# EAGLE design NanoV3.3 new board (EAGLE 9.3.2)
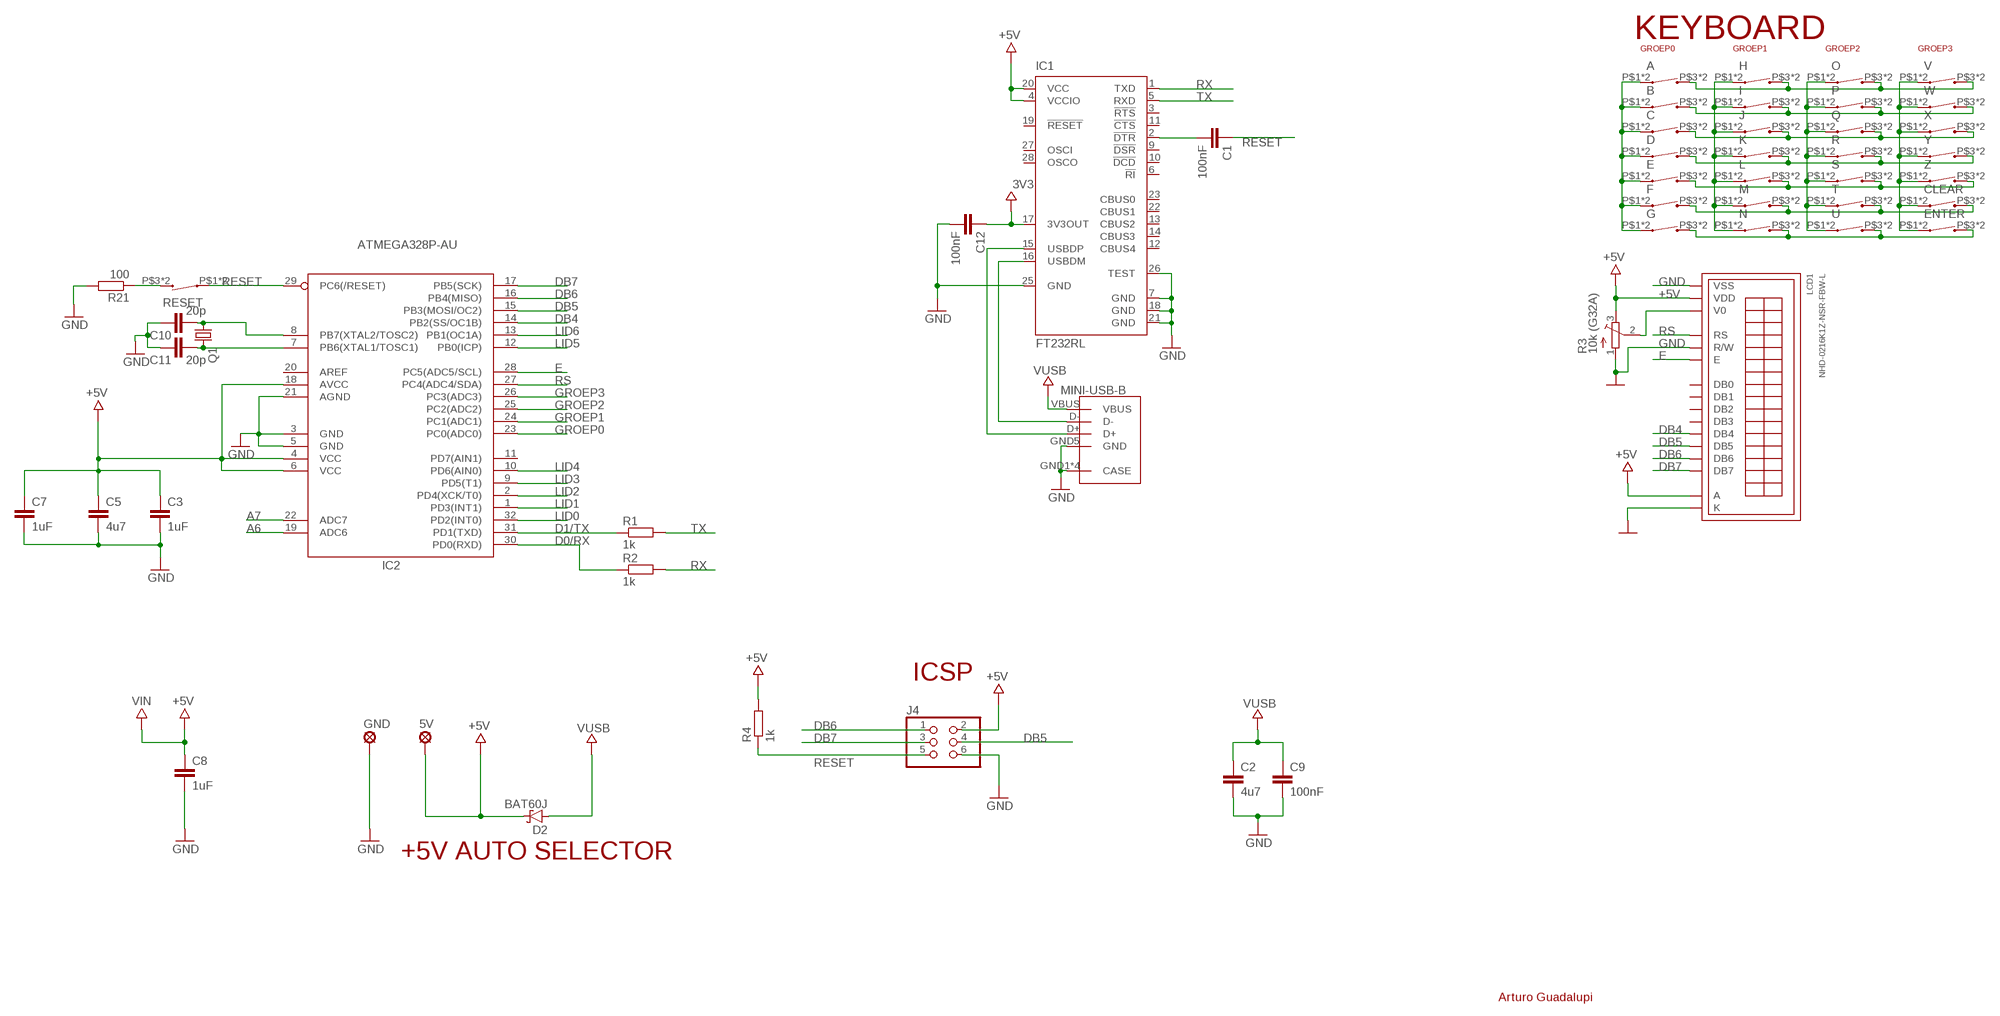
[diagram p0: schematic, sheet 1]

## Parts
5V  LSP10  [LSP10]
A  BRIGHTTSA061G100-250_SWITCH  [BRIGHTTSA061G100-250]
B  BRIGHTTSA061G100-250_SWITCH  [BRIGHTTSA061G100-250]
C  BRIGHTTSA061G100-250_SWITCH  [BRIGHTTSA061G100-250]
C1  100nF  C-EUC0805  [C0805]
C2  4u7  C-EUC0805  [C0805]
C3  1uF  C-EUC0805  [C0805]
C5  4u7  C-EUC0805  [C0805]
C7  1uF  C-EUC0805  [C0805]
C8  1uF  C-EUC0805  [C0805]
C9  100nF  C-EUC0805  [C0805]
C10  20p  C-EUC0805  [C0805]
C11  20p  C-EUC0805  [C0805]
C12  100nF  C-EUC0805  [C0805]
CLEAR  BRIGHTTSA061G100-250_SWITCH  [BRIGHTTSA061G100-250]
D  BRIGHTTSA061G100-250_SWITCH  [BRIGHTTSA061G100-250]
D2  BAT60J  [SOD323_ST]
E  BRIGHTTSA061G100-250_SWITCH  [BRIGHTTSA061G100-250]
ENTER  BRIGHTTSA061G100-250_SWITCH  [BRIGHTTSA061G100-250]
F  BRIGHTTSA061G100-250_SWITCH  [BRIGHTTSA061G100-250]
G  BRIGHTTSA061G100-250_SWITCH  [BRIGHTTSA061G100-250]
GND  LSP10  [LSP10]
H  BRIGHTTSA061G100-250_SWITCH  [BRIGHTTSA061G100-250]
I  BRIGHTTSA061G100-250_SWITCH  [BRIGHTTSA061G100-250]
IC1  FT232RL  [SSOP28]
IC2  ATMEGA328P-AU  ATMEGA328P-32AU  [TQFP32-08]
J  BRIGHTTSA061G100-250_SWITCH  [BRIGHTTSA061G100-250]
J4  0114_PH254-203DF118A00V  [2X03]
K  BRIGHTTSA061G100-250_SWITCH  [BRIGHTTSA061G100-250]
L  BRIGHTTSA061G100-250_SWITCH  [BRIGHTTSA061G100-250]
LCD1  NHD-0216K1Z-NSR-FBW-L  GEN-DISPLAY-16X2-LCD  [LCD_NO-HEAD]
M  BRIGHTTSA061G100-250_SWITCH  [BRIGHTTSA061G100-250]
MINI-USB-B  MINI_USB_B-KRHRO-SELECU-M-M5DS-W-4  [KRHROSELECU-M-M5DS-W-4]
N  BRIGHTTSA061G100-250_SWITCH  [BRIGHTTSA061G100-250]
O  BRIGHTTSA061G100-250_SWITCH  [BRIGHTTSA061G100-250]
P  BRIGHTTSA061G100-250_SWITCH  [BRIGHTTSA061G100-250]
Q  BRIGHTTSA061G100-250_SWITCH  [BRIGHTTSA061G100-250]
Q1  CRYSTALHC49U70  [HC49U70]
R  BRIGHTTSA061G100-250_SWITCH  [BRIGHTTSA061G100-250]
R1  1k  R-EU_R0805  [R0805]
R2  1k  R-EU_R0805  [R0805]
R3  10k (G32A)  TRIM_EU-3223W  [3223W]
R4  1k  R-EU_R0805  [R0805]
R21  100  R-EU_R0805  [R0805]
RESET  BRIGHTTSA061G100-250_SWITCH  [BRIGHTTSA061G100-250]
S  BRIGHTTSA061G100-250_SWITCH  [BRIGHTTSA061G100-250]
T  BRIGHTTSA061G100-250_SWITCH  [BRIGHTTSA061G100-250]
U  BRIGHTTSA061G100-250_SWITCH  [BRIGHTTSA061G100-250]
V  BRIGHTTSA061G100-250_SWITCH  [BRIGHTTSA061G100-250]
W  BRIGHTTSA061G100-250_SWITCH  [BRIGHTTSA061G100-250]
X  BRIGHTTSA061G100-250_SWITCH  [BRIGHTTSA061G100-250]
Y  BRIGHTTSA061G100-250_SWITCH  [BRIGHTTSA061G100-250]
Z  BRIGHTTSA061G100-250_SWITCH  [BRIGHTTSA061G100-250]

## Nets
3V3 [small]: C12.1 IC1.17(3V3OUT)
+5V [small]: 5V.MP C3.1 C5.1 C7.1 C8.1 D2.C IC1.4(VCCIO) IC1.20(VCC) IC2.4(VCC) IC2.6(VCC) IC2.18(AVCC) J4.2 LCD1.2(VDD) LCD1.15(A) R3.3(E) R4.2 ; supply symbol labelled VIN
A6: IC2.19(ADC6)
A7: IC2.22(ADC7)
D0/RX [small]: IC2.30(PD0(RXD)) R2.1
D1/TX [small]: IC2.31(PD1(TXD)) R1.1
DB4 [small]: IC2.14(PB2(SS/OC1B)) LCD1.11(DB4)
DB5 [small]: IC2.15(PB3(MOSI/OC2)) J4.4 LCD1.12(DB5)
DB6 [small]: IC2.16(PB4(MISO)) J4.1 LCD1.13(DB6)
DB7 [small]: IC2.17(PB5(SCK)) J4.3 LCD1.14(DB7)
E: IC2.28(PC5(ADC5/SCL)) LCD1.6(E)
GND [small]: C2.2 C3.2 C5.2 C7.2 C8.2 C9.2 C10.1 C11.1 C12.2 GND.MP IC1.7(GND) IC1.18(GND) IC1.21(GND) IC1.25(GND) IC1.26(TEST) IC2.3(GND) IC2.5(GND) IC2.21(AGND) J4.6 LCD1.1(VSS) LCD1.5(R/W) LCD1.16(K) MINI-USB-B.GND1(CASE) MINI-USB-B.GND2(CASE) MINI-USB-B.GND3(CASE) MINI-USB-B.GND4(CASE) MINI-USB-B.GND5(GND) R3.1(A) R21.2
GROEP0: A.P$1 A.P$2 B.P$1 B.P$2 C.P$1 C.P$2 D.P$1 D.P$2 E.P$1 E.P$2 F.P$1 F.P$2 G.P$1 G.P$2 IC2.23(PC0(ADC0))
GROEP1: H.P$1 H.P$2 I.P$1 I.P$2 IC2.24(PC1(ADC1)) J.P$1 J.P$2 K.P$1 K.P$2 L.P$1 L.P$2 M.P$1 M.P$2 N.P$1 N.P$2
GROEP2: IC2.25(PC2(ADC2)) O.P$1 O.P$2 P.P$1 P.P$2 Q.P$1 Q.P$2 R.P$1 R.P$2 S.P$1 S.P$2 T.P$1 T.P$2 U.P$1 U.P$2
GROEP3: CLEAR.P$1 CLEAR.P$2 ENTER.P$1 ENTER.P$2 IC2.26(PC3(ADC3)) V.P$1 V.P$2 W.P$1 W.P$2 X.P$1 X.P$2 Y.P$1 Y.P$2 Z.P$1 Z.P$2
LID0: A.P$3 A.P$4 H.P$3 H.P$4 IC2.32(PD2(INT0)) O.P$3 O.P$4 V.P$3 V.P$4
LID1: B.P$3 B.P$4 I.P$3 I.P$4 IC2.1(PD3(INT1)) P.P$3 P.P$4 W.P$3 W.P$4
LID2: C.P$3 C.P$4 IC2.2(PD4(XCK/T0)) J.P$3 J.P$4 Q.P$3 Q.P$4 X.P$3 X.P$4
LID3: D.P$3 D.P$4 IC2.9(PD5(T1)) K.P$3 K.P$4 R.P$3 R.P$4 Y.P$3 Y.P$4
LID4: E.P$3 E.P$4 IC2.10(PD6(AIN0)) L.P$3 L.P$4 S.P$3 S.P$4 Z.P$3 Z.P$4
LID5: CLEAR.P$3 CLEAR.P$4 F.P$3 F.P$4 IC2.12(PB0(ICP)) M.P$3 M.P$4 T.P$3 T.P$4
LID6: ENTER.P$3 ENTER.P$4 G.P$3 G.P$4 IC2.13(PB1(OC1A)) N.P$3 N.P$4 U.P$3 U.P$4
N$1: C10.2 IC2.8(PB7(XTAL2/TOSC2)) Q1.1
N$2: C11.2 IC2.7(PB6(XTAL1/TOSC1)) Q1.2
N$3: LCD1.3(V0) R3.2(S)
N$5: IC1.15(USBDP) MINI-USB-B.D+
N$6: IC1.16(USBDM) MINI-USB-B.D-
N$8: C1.2 IC1.2(!DTR)
N$15: R21.1 RESET.P$3 RESET.P$4
RESET: C1.1 IC2.29(PC6(/RESET)) J4.5 R4.1 RESET.P$1 RESET.P$2
RS: IC2.27(PC4(ADC4/SDA)) LCD1.4(RS)
RX [small]: IC1.1(TXD) R2.2
TX [small]: IC1.5(RXD) R1.2
VUSB: C2.1 C9.1 D2.A MINI-USB-B.VBUS
Unconnected: IC1.3(!RTS) IC1.6(!RI) IC1.9(!DSR) IC1.10(!DCD) IC1.11(!CTS) IC1.12(CBUS4) IC1.13(CBUS2) IC1.14(CBUS3) IC1.19(!RESET) IC1.22(CBUS1) IC1.23(CBUS0) IC1.27(OSCI) IC1.28(OSCO) IC2.11(PD7(AIN1)) IC2.20(AREF) LCD1.7(DB0) LCD1.8(DB1) LCD1.9(DB2) LCD1.10(DB3)

## Notes on the sheet
- KEYBOARD
- GROEP0 | GROEP1 | GROEP2 | GROEP3
- ICSP
- +5V AUTO SELECTOR
- Arturo Guadalupi

## Library data of the parts
5V GND = solpad:LSP10: SOLDER PAD drill 1.0 mm, distributor Buerklin, 12H555
A B C CLEAR D E ENTER F G H I J K L M N O P Q R RESET S T U V W X Y Z = switch BRIGHT TSA061G100-250lbr:BRIGHTTSA061G100-250_SWITCH
C1-C3 C5 C7-C12 = rcl:C-EU: CAPACITOR, European symbol; SPICEPREFIX: C
D2 = diode:BAT60J: Schottky barrier diode Source: www.st.com, BAT60J.pdf
IC1 = ftdichip:FT232R: Source: http://www.ftdichip.com/Documents/DataSheets/DS_FT232R_v104.pdf; MPN: FT232RL; OC_FARNELL: 1146032; OC_NEWARK: 91K9918
IC2 = Arduino-ucs&SoCs:ATMEGA328P-32: 8-bit Microcontroller with 32KBytes In-System Programmable Flash ATMEGA328P-AU; DATASHEET: http://www.atmel.com/images/Atmel-8271-8-bit-AVR-Microcontroller-ATmega48A-48PA-88A-88PA-168A-168PA-328-328P_datasheet_Complete.pdf; DISTRIBUTOR-LINK: https://www.digikey.it/product-detail/it/microchip-technology/ATMEGA328P-AU/ATMEGA328P-AU-ND/1832260; DISTRIBUTOR-PN: ATMEGA328P-AU-ND; MANUFACTURER: ATMEL; MANUFACTURER-PN: ATMEGA328P-AU
J4 = Connettori:0114_PH254-203DF118A00V: 3x2 M V h 8,5 mm p2,54; MONTHLY_USAGE: _____; PART_NUMBER: PH254-203DF118A00V; PRICE: _____; SUPPLIER: _____; TYPE: Connettori; VALUE: ICSP
LCD1 = lcd:GEN-DISPLAY-16X2-LCD: Display a cristalli liquidi tipo 162B Displaytech http://www.displaytech.com.hk/index.htm
MINI-USB-B = mini USB B Korean Hroparts Elec U-M-M5DS-W-4:MINI_USB_B-KRHRO-SELECU-M-M5DS-W-4: order from lcsc: https://lcsc.com/product-detail/USB-Connectors_Korean-Hroparts-Elec-U-M-M5DS-W-4_C188818.html datasheet: https://datasheet.lcsc.com/szlcsc/Korean-Hroparts-Elec-U-M-M5DS-W-4_C188818.pdf
Q1 = crystal:CRYSTAL: CRYSTAL; OC_FARNELL: unknown; OC_NEWARK: unknown
R1 R2 R4 R21 = rcl:R-EU_: RESISTOR, European symbol; SPICEPREFIX: R
R3 = pot:TRIM_EU-: POTENTIOMETER

## Net classes
0 default: width 0.254 mm, clearance 0.152 mm
1 small: width 0.381 mm, clearance 0.152 mm
2 very small: width 0.254 mm, clearance 0.152 mm

## Board
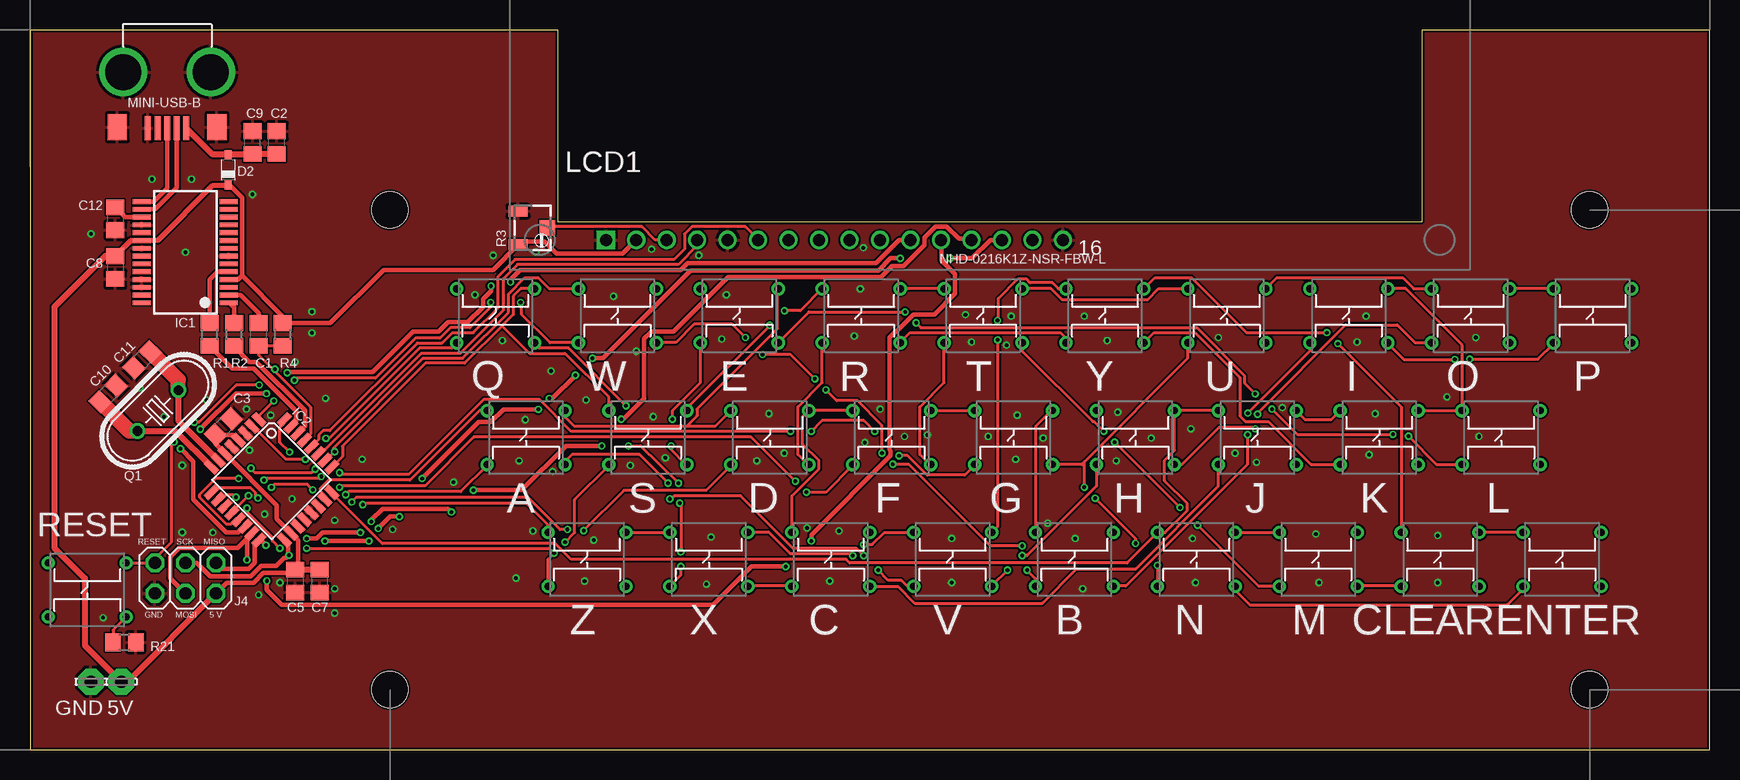
[diagram p1: board, top side]
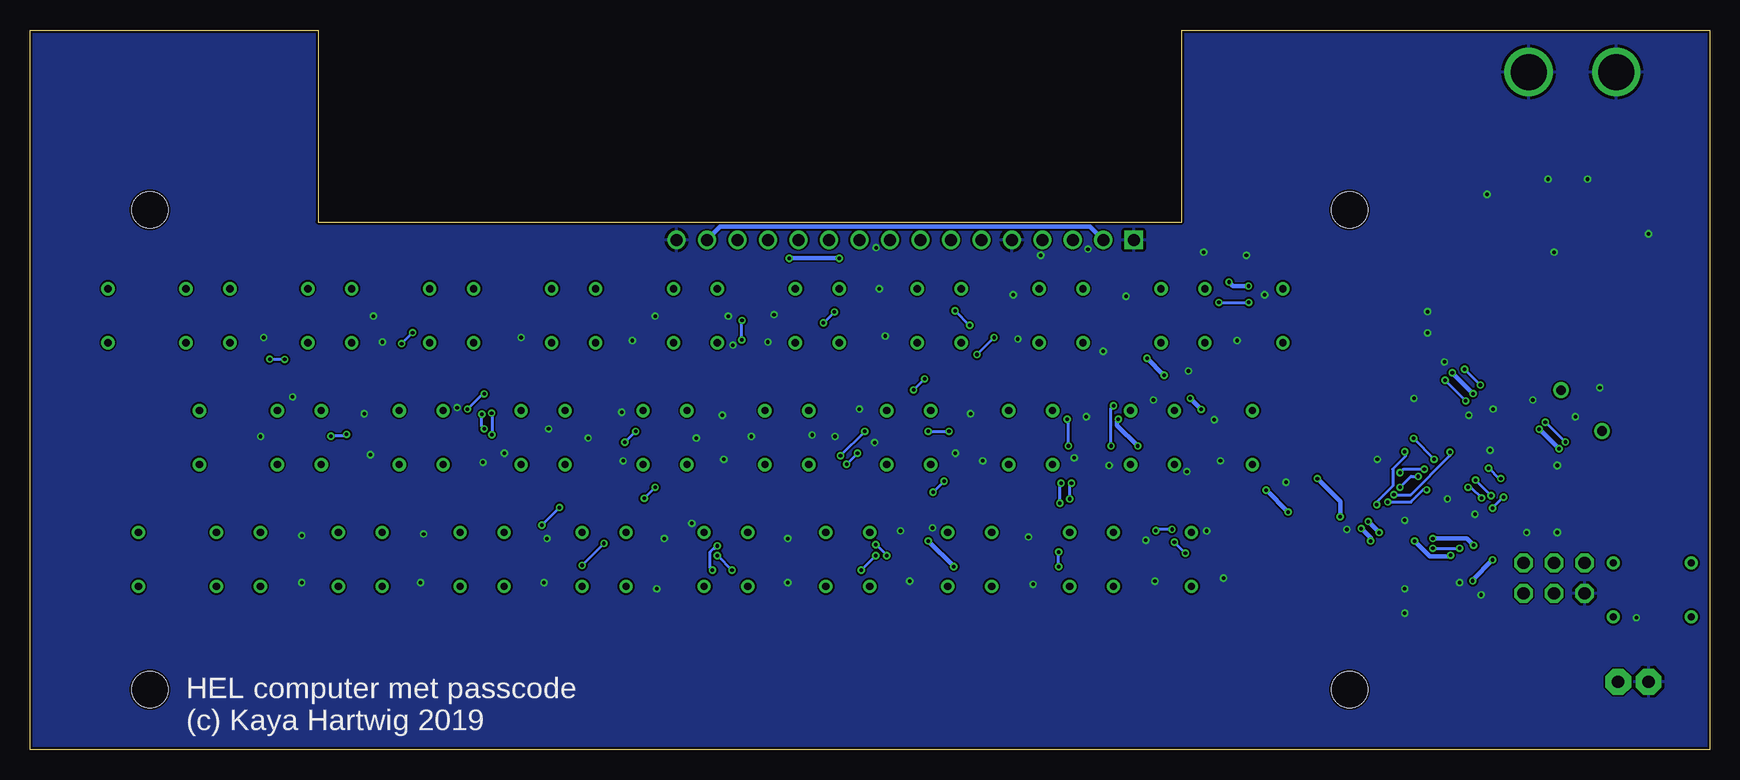
[diagram p2: board, bottom side, seen from below]

Size 140 x 60 mm. Coordinates in mm from the lower left corner, seen from the top.
Outline: 0,0 140,0 140,60 116,60 116,44 44,44 44,60 0,60 0,0
Copper layers (1*16): Top 0.035mm / dielectric 1.5mm / Bottom 0.035mm
Design rules "default": minimum track width 5mil, minimum drill 0.3mm, track to track 5mil, track to pad 5mil, pad to pad 5mil, via to via 5mil, smd to smd 5mil, copper to edge 0.2mm, drill to drill 6mil, minimum pad ring 10mil, minimum via ring 0.15mm, stop-mask expansion 4mil, vias tented up to drill 0mil, thermal gap 10mil
Holes 3 mm at 130,45 30,45 30,5 130,5

### Footprints (pad centres in the part's own frame; a part is rotated, then mirrored left to right if it is on the bottom)
LSP10 = drill 1.016 pad 2.159 octagon: MP 0,0
BRIGHTTSA061G100-250 = drill 0.6: P$1 0,0; P$2 6.5,0; P$3 0,-4.5; P$4 6.5,-4.5
C0805 = smd 1.3 x 1.5: 1 -0.95,0; 2 0.95,0
SOD323_ST = smd 0.8 x 0.6: A 1.25,0; C -1.25,0
SSOP28 = smd 0.4 x 1.5: 1 -4.225,-3.625; 2 -3.575,-3.625; 3 -2.925,-3.625; 4 -2.275,-3.625; 5 -1.625,-3.625; 6 -0.975,-3.625; 7 -0.325,-3.625; 8 0.325,-3.625; 9 0.975,-3.625; 10 1.625,-3.625; 11 2.275,-3.625; 12 2.925,-3.625; 13 3.575,-3.625; 14 4.225,-3.625; 15 4.225,3.625; 16 3.575,3.625; 17 2.925,3.625; 18 2.275,3.625; 19 1.625,3.625; 20 0.975,3.625; 21 0.325,3.625; 22 -0.325,3.625; 23 -0.975,3.625; 24 -1.625,3.625; 25 -2.275,3.625; 26 -2.925,3.625; 27 -3.575,3.625; 28 -4.225,3.625
TQFP32-08 = smd 1.27 x 0.559: 1 -4.293,2.8; 2 -4.293,2; 3 -4.293,1.2; 4 -4.293,0.4; 5 -4.293,-0.4; 6 -4.293,-1.2; 7 -4.293,-2; 8 -4.293,-2.8; 17 4.293,-2.8; 18 4.293,-2; 19 4.293,-1.2; 20 4.293,-0.4; 21 4.293,0.4; 22 4.293,1.2; 23 4.293,2; 24 4.293,2.8 | smd 0.559 x 1.27: 9 -2.8,-4.293; 10 -2,-4.293; 11 -1.2,-4.293; 12 -0.4,-4.293; 13 0.4,-4.293; 14 1.2,-4.293; 15 2,-4.293; 16 2.8,-4.293; 25 2.8,4.293; 26 2,4.293; 27 1.2,4.293; 28 0.4,4.293; 29 -0.4,4.293; 30 -1.2,4.293; 31 -2,4.293; 32 -2.8,4.293
2X03 = drill 1.016 pad 1.55 octagon: 1 -2.54,-1.27; 2 -2.54,1.27; 3 0,-1.27; 4 0,1.27; 5 2.54,-1.27; 6 2.54,1.27
LCD_NO-HEAD = drill 1 square: 1 8,2.5 | drill 1: 2 10.54,2.5; 3 13.08,2.5; 4 15.62,2.5; 5 18.16,2.5; 6 20.7,2.5; 7 23.24,2.5; 8 25.78,2.5; 9 28.32,2.5; 10 30.86,2.5; 11 33.4,2.5; 12 35.94,2.5; 13 38.48,2.5; 14 41.02,2.5; 15 43.56,2.5; 16 46.1,2.5
KRHROSELECU-M-M5DS-W-4 = smd 0.5 x 2: D+ 0,-0.8; D- -0.8,-0.8; GND5 1.6,-0.8; P$2 0.8,-0.8; VBUS -1.6,-0.8 | smd 1.6 x 2.2: GND1 -4.15,-0.9; GND2 4.15,-0.9 | drill 3: GND3 3.65,-5.5; GND4 -3.65,-5.5
HC49U70 = drill 0.813: 1 -2.413,0; 2 2.413,0
R0805 = smd 1.3 x 1.5: 1 -0.95,0; 2 0.95,0
3223W = smd 0.9 x 1.6: 1 -1.4,-1.215; 3 1.4,-1.215 | smd 1.3 x 1.3: 2 0,1.215

### Placement (x,y rotation side)
5V  7.62,5.65 0 top
A  38.1,28.26 0 top
B  83.82,18.1 0 top
C  63.5,18.1 0 top
C1  19.05,34.61 90 top
C2  20.57,50.61 90 top
C3  16.13,26.91 45 top
C5  22.1,14.04 270 top
C7  24.13,14.04 270 top
C8  7.11,40.2 270 top
C9  18.54,50.61 90 top
C10  6.51,29.67 225 top
C11  9.35,32.5 45 top
C12  7.11,44.26 270 top
CLEAR  114.3,18.1 0 top
D  58.42,28.26 0 top
D2  16.51,48.33 90 top
E  55.88,38.42 0 top
ENTER  124.46,18.1 0 top
F  68.58,28.26 0 top
G  78.74,28.26 0 top
GND  5.08,5.65 0 top
H  88.9,28.26 0 top
I  106.68,38.42 0 top
IC1  12.95,41.47 90 top
IC2  20.14,22.49 315 top
J  99.06,28.26 0 top
J4  12.95,14.29 180 top
K  109.22,28.26 0 top
L  119.38,28.26 0 top
LCD1  40,40 0 top
M  104.14,18.1 0 top
MINI-USB-B  11.43,51 180 top
N  93.98,18.1 0 top
O  116.84,38.42 0 top
P  127,38.42 0 top
Q  35.56,38.42 0 top
Q1  10.67,28.26 45 top
R  66.04,38.42 0 top
R1  14.99,34.61 90 top
R2  17.02,34.61 90 top
R3  41.91,43.5 270 top
R4  21.08,34.61 90 top
R21  7.87,8.96 0 top
RESET  1.52,15.56 0 top
S  48.26,28.26 0 top
T  76.2,38.42 0 top
U  96.52,38.42 0 top
V  73.66,18.1 0 top
W  45.72,38.42 0 top
X  53.34,18.1 0 top
Y  86.36,38.42 0 top
Z  43.18,18.1 0 top

### Tracks (layer width: path | path; a pad name or v marks a point on that pad's centre or on a via)
3V3
  Top 0.381: IC1.17 7.93,44.39 C12.1
+5V
  Top 0.381: 22.35,14.99 22.35,17.45 IC2.18 20.57,19.23 20.57,20.36 IC2.6 15.43,25.5 C3.1 16.96,26.24 IC2.4 | 16.49,47.06 D2.C 16.63,47.08 17.67,46.03 17.67,39.5 | 6.28,41.15 C8.1 | 17.67,39.5 17.36,39.19 IC1.4 | 17.67,39.5 21.08,36.09 R4.2 21.09,35.55 25.02,35.55 29.46,39.99 38.59,39.99 R3.3 40.95,42.35 42.9,42.35 43.89,41.37 49.38,41.37 50.49,42.48 LCD1.2 | C5.1 21.83,14.71 19.44,14.71 18.63,13.9 16.38,13.9 J4.2
  Top 0.432: C8.1 8.41,42.44 IC1.20 10.63,42.44 15.24,47.06 16.49,47.06
  Top 0.508: 6.28,41.15 2.03,36.9 2.03,16.83 4.57,14.29 4.57,8.7 5V.MP 8.13,5.65 J4.2 | C7.1 22.35,14.99 C5.1
  Bottom 0.381: LCD1.15 82.46,43.6 51.64,43.6 LCD1.2
D0/RX
  Top 0.381: IC2.30 22.92,26.97 22.92,28.26 18.86,32.32 18.29,32.32 17.02,33.59 R2.1
D1/TX
  Top 0.381: R1.1 16.86,31.79 18.64,31.79 22.18,28.24 22.18,27.37 IC2.31
DB4  (via drill 0.3 pad 0.6)
  Top 0.381: v12.55,25.09 13.61,24.02 13.61,20.84 16.36,18.1 17.37,18.1 17.88,18.61 IC2.14 | v19.71,29.68 17.17,29.68 v14.2,26.71 | v21.44,31.41 21.49,31.46 28.55,31.46 31.93,34.84 34.05,34.84 34.85,35.64 36.48,35.64 37.76,36.91 37.76,37.55 38.43,38.22 v38.43,38.65 | LCD1.11 73.36,42.48 72.44,42.48 70.51,40.55 54.82,40.55 54.25,39.98 40.84,39.98 40.06,39.2 v40.06,38.98
  Bottom 0.381: v21.44,31.41 v19.71,29.68 | v14.2,26.71 12.57,25.09 v12.55,25.09 | v40.06,38.98 39.73,38.65 v38.43,38.65
DB5  (via drill 0.3 pad 0.6)
  Top 0.381: v19.74,14.06 19.74,13.3 20.98,12.05 56.95,12.05 60.15,15.26 v62.99,15.26 | v65.13,17.39 65.13,17.9 71.73,24.5 71.73,24.91 71.63,25.01 71.63,34.36 72.14,34.86 72.24,34.86 73.66,36.29 75.39,36.29 77.11,38.01 77.11,39.64 76,40.76 76,42.48 LCD1.12 | IC2.15 18.09,17.61 | 18.09,17.61 v18.09,15.81 | 18.09,17.61 17.31,16.83 12.45,16.83 11.68,16.07 11.68,14.29 J4.4
  Bottom 0.381: v19.74,14.06 19.74,14.16 v18.09,15.81 | v65.13,17.39 v62.99,15.26
DB6  (via drill 0.3 pad 0.6)
  Top 0.381: v19.66,17.03 19.3,17.39 19.1,17.39 IC2.16 18.73,17.12 18.73,15.55 18.23,15.05 16,15.05 J4.1 | v23.06,17.59 23.88,17.59 24.38,18.1 v27.53,18.1 | v36.96,21.63 41,21.63 44.68,25.31 v47.65,25.31 | v28.45,19.01 28.45,19.14 29.38,20.07 34.86,20.07 v35.13,19.8 | 74.57,42.08 74.57,42.69 75.49,43.6 76.4,43.6 77.42,42.59 78.44,42.59 LCD1.13 | v49.28,27.55 49.48,27.55 51.21,29.28 51.21,34.25 51.82,34.86 53.65,34.86 58.19,39.41 70.94,39.41 71.84,40.31 72.81,40.31 74.57,42.08 | 74.57,42.08
  Bottom 0.381: v19.66,17.03 20.22,17.59 v23.06,17.59 | v28.45,19.01 v27.53,18.1 | v36.96,21.63 v35.13,19.8 | v47.65,25.31 49.38,27.04 49.38,27.45 v49.28,27.55
DB7  (via drill 0.3 pad 0.6)
  Top 0.381: v28.25,17.39 v24.59,17.39 | v30.79,19.42 30.02,19.42 v29.03,18.43 | v32.69,22.6 37.39,27.3 38.41,27.3 39.47,28.36 v42.37,28.36 | IC2.17 21.23,17.39 21.54,17.08 21.54,16.25 v21.59,16.2 21.37,15.98 21.2,15.98 20.53,15.31 19.26,15.31 18.39,14.44 15.03,14.44 13.91,15.56 J4.3 | v45.47,31.21 43.54,29.28 v43.28,29.28 | v76.71,40.96 78.54,40.96 80.06,42.48 80.97,42.48 LCD1.14 | v72.54,40.96 71.73,40.96 70.71,39.94 55.07,39.94 47.75,32.63 v46.89,32.63
  Bottom 0.381: v21.59,16.2 21.67,16.12 23.32,16.12 v24.59,17.39 | v29.03,18.43 28.25,17.64 v28.25,17.39 | v32.69,22.6 30.79,20.69 v30.79,19.42 | v43.28,29.28 v42.37,28.36 | v46.89,32.63 v45.47,31.21 | v72.54,40.96 v76.71,40.96
E
  Top 0.254: IC2.28 23.46,25.25 24.08,25.87 24.08,26.23 24.43,26.58 24.98,26.58 32.3,33.9 34.35,33.9 35.21,34.76 36.96,34.76 39.01,36.82 39.01,39.44 40.44,40.86 53.7,40.86 54.56,41.72 54.56,42.99 55.17,43.6 59.64,43.6 60.66,42.59 LCD1.6
GND  (via drill 0.3 pad 0.6, 0.35)
  other vias: 11.18,27.75 5.08,42.99 10.16,47.56 13.46,47.56 9.14,30.16 12.95,41.47 20.07,27.88 18.54,46.29 38.61,41.21 23.5,34.74 22.1,32.32 24.64,29.28 37.08,37.91 39.37,34.1 27.69,24.2 43.43,31.56 6.1,10.99 15.24,18.1 19.56,19.62 21.84,20.89 18.29,24.96 25.4,19.12 20.83,13.91 25.4,13.4 40.51,14.29 19.05,12.89 25.4,11.37 120.52,34.36 120.78,26.1 117.35,17.85 117.35,13.91 107.44,13.91 107.19,17.97 102.23,23.94 111.63,24.58 112.14,28.01 104.39,28.51 118.11,29.4 110.62,33.98 111.38,36.13 99.06,34.36 87.88,36.13 89.79,34.1 90.68,28.13 93.47,25.97 100.46,24.7 96.77,26.74 96.9,17.59 97.16,13.91 87.76,13.4 87.12,17.59 84.84,18.86 84.45,25.97 82.3,27.88 82.17,24.2 79.88,26.1 78.49,33.98 81.41,33.72 74.8,26.23 76.83,17.59 76.83,13.91 66.67,14.04 67.44,18.23 64.77,18.48 69.6,25.59 68.71,34.48 69.22,38.42 48.64,37.78 58.04,37.91 42.16,41.47 69.47,41.85 50.55,33.21 51.94,27.75 57.66,34.23 72.9,26.1 56.77,17.72 56.39,13.78 46.23,14.04 46.99,17.47 50.04,23.69 40.77,24.07 41.27,27.5 77.98,36.26 70.87,28.39 61.59,28.01 62.87,24.7 60.58,24.07 52.96,24.32 43.56,23.18 41.91,18.23 30.23,18.35 35.31,22.29 90.55,24.07 81.79,36.13 14.73,29.15 18.03,28.39 46.35,29.15 55.75,41.21 51.82,41.72 23.5,36.52 12.7,23.69 12.7,18.1
  pour Bottom: -3.81,63.82 143.51,63.82 143.51,-4.68 -3.81,-4.68
  pour Top: -1.52,61.28 141.99,61.28 141.99,-2.47 -1.78,-2.47 -1.78,61.28
GROEP0
  Top 0.254: A.P$1 37.47,28.26 31.67,22.47 24.89,22.47 24.18,21.76 24.18,21.55 24.59,21.15 24.59,20.95 IC2.23 | F.P$1 D.P$2 64.41,27.75 64.41,25.44 65.75,24.1 65.75,23.4 63.5,21.15 C.P$1 | E.P$2 62.28,38.42 62.28,35.07 55.59,28.38 55.59,27.82 54.71,26.94 | F.P$2 G.P$1 | B.P$1 83.82,26.94 85.14,28.26 G.P$2 | A.P$2 44.6,27.73 45.39,26.94 54.71,26.94 | D.P$1 57.1,26.94 54.71,26.94
GROEP1
  Top 0.254: J.P$1 H.P$2 95.4,28.16 95.4,24.94 94.57,24.1 94.57,22.4 96.46,20.5 96.46,19.94 94.62,18.1 N.P$1 91.44,15.56 68.33,15.56 68.02,15.87 45.11,15.87 43.79,17.19 29.36,17.19 25.2,21.35 IC2.24 | J.P$2 106.32,27.5 108.46,27.5 K.P$1 | K.P$2 L.P$1 119.38,33.72 114.68,38.42 I.P$2 | N.P$2 M.P$1
GROEP2  (via drill 0.3 pad 0.6)
  Top 0.254: IC2.25 26.05,24.44 26.05,25.3 32.97,32.22 36.24,32.22 39.34,35.32 39.37,35.32 | S.P$1 48.26,29.38 44.6,33.03 41.66,33.03 39.37,35.32 | P.P$1 O.P$2 | T.P$1 R.P$2 | U.P$1 94.08,38.42 93.17,37.51 86.03,37.51 85.11,38.42 T.P$2 | O.P$1 115.34,38.42 114.43,39.33 103.94,39.33 U.P$2 | v61.67,35.37 54.76,28.46 S.P$2 | v62.89,36.59 64.21,36.59 R.P$1 | Q.P$2 40.91,38.42 40.28,37.79 40.28,36.27 39.37,35.36 39.37,35.32
  Bottom 0.254: v62.89,36.59 v61.67,35.37
GROEP3  (via drill 0.3 pad 0.6)
  Top 0.254: ENTER.P$1 CLEAR.P$2 | v27.74,20.41 27.86,20.54 41.38,20.54 43.18,18.73 Z.P$1 | IC2.26 24.69,24.2 24.74,24.2 25.35,24.81 v25.4,24.83 25.3,25.14 32.79,32.63 36.07,32.63 39.88,36.44 39.88,37.96 41.25,39.33 42.37,39.33 43.28,38.42 W.P$1 | Z.P$2 X.P$1 | V.P$1 71.22,18.1 70.21,17.08 v69.49,17.08 | v68.58,16.17 68.38,16.37 63.35,16.37 61.62,18.1 X.P$2 | v80.67,34.15 80.67,18.61 V.P$2 | CLEAR.P$1 114.3,28.56 v109.02,33.85 | v108.1,34.76 101.4,34.76 96.83,39.33 93.78,39.33 Y.P$2 | v80.64,35.78 80.72,35.86 80.72,37.62 82.36,39.25 83.05,39.25 83.37,38.93 85.22,38.93 85.72,38.42 Y.P$1
  Bottom 0.254: v25.4,24.83 25.35,24.45 26.42,23.38 26.42,21.97 27.66,20.73 27.66,20.49 v27.74,20.41 | v68.58,16.17 v69.49,17.08 | v80.67,34.15 80.67,35.75 v80.64,35.78 | v108.1,34.76 v109.02,33.85
LID0  (via drill 0.3 pad 0.6)
  Top 0.254: v21.64,24.81 20.83,25.62 20.83,26.84 21.13,27.14 21.13,27.45 IC2.32 | v26.31,21.25 26.57,21.5 35.92,21.5 38.1,23.69 A.P$3 | v81.48,14.95 80.16,13.63 V.P$4 | v82.7,16.17 83.11,16.17 88.9,21.96 H.P$3 | v102.34,27.95 102.34,28.08 109.65,35.4 113.97,35.4 115.42,33.95 116.84,33.95 O.P$3 | v102.13,26.74 102.01,26.86 99.11,26.86 96.01,23.76 H.P$4 | A.P$4 44.6,24.02 45.19,24.6 50.8,24.6 v53.19,22.22 | v53.34,20.89 53.7,21.15 59.23,21.15 63.6,16.78 68.89,16.78 v69.49,16.17 | V.P$3 73.15,13.6 72.64,14.11 71.53,14.11 70.71,14.92 v70.71,14.95
  Bottom 0.254: v21.64,24.81 21.64,24.5 24.89,21.25 v26.31,21.25 | v82.7,16.17 v81.48,14.95 | v102.34,27.95 102.34,26.94 v102.13,26.74 | v70.71,14.95 v69.49,16.17 | v53.19,22.22 53.34,22.06 v53.34,20.89
LID1  (via drill 0.3 pad 0.6)
  Top 0.254: v20.32,29.07 19.1,27.85 19.1,27.55 IC2.1 | v22.05,30.8 22.23,30.98 28.8,30.98 32.13,34.3 34.18,34.3 35.05,35.17 36.68,35.17 38.41,36.9 v38.41,37.28 | W.P$3 43.34,33.92 40.97,36.29 40.97,37.2 v40.89,37.28 | v101.5,26.25 101.5,23.79 91.34,13.63 90.32,13.63 B.P$4 | I.P$3 106.68,33.21 v101.52,28.06 | v118.77,32.53 114.5,32.53 113.18,33.85 I.P$4 | P.P$3 127,33.85 125.7,32.55 v120.02,32.55 | v59.64,34.36 58.52,35.47 55.37,35.47 53.85,33.95 52.22,33.95 W.P$4 | v61.06,32.93 63.4,32.93 v65.43,30.9 | v66.34,29.99 67.23,29.1 68.96,29.1 71.02,27.04 v71.02,24.7 | v71.93,23.79 73.25,23.79 80.06,16.98 v82.7,16.98 | v83.11,14.95 83.82,14.24 B.P$3
  Bottom 0.254: v22.05,30.8 v20.32,29.07 | v101.52,28.06 101.5,28.03 v101.5,26.25 | v120.02,32.55 119.91,32.53 v118.77,32.53 | v61.06,32.93 v59.64,34.36 | v66.34,29.99 v65.43,30.9 | v71.93,23.79 v71.02,24.7 | v82.7,16.98 82.91,16.78 83.01,16.78 83.31,16.47 83.31,15.15 v83.11,14.95 | v40.89,37.28 v38.41,37.28
LID2  (via drill 0.3 pad 0.6)
  Top 0.254: v22.96,24.2 21.34,24.2 18.59,26.94 IC2.2 | Q.P$3 35.18,33.54 35.18,33.47 32.46,33.47 24.94,25.95 v24.66,25.95 | X.P$4 59.84,13.63 63.5,13.63 C.P$3 | J.P$3 99.06,21.96 92.18,15.08 87.25,15.08 84.38,12.21 73.74,12.21 72.34,13.6 C.P$4 | v49.68,28.67 44.88,33.47 42.46,33.47 42.46,33.52 Q.P$4 | v54.05,22.22 50.9,25.31 v49.89,25.31 | v54.15,20.54 54.25,20.44 v54.25,16.47 | v54.25,15.26 54.25,14.54 53.34,13.63 X.P$3
  Bottom 0.254: v49.68,28.67 49.89,28.46 v49.89,25.31 | v54.15,20.54 54.15,22.06 v54.05,22.22 | v54.25,15.26 v54.25,16.47 | v24.66,25.95 22.96,24.25 v22.96,24.2
LID3  (via drill 0.3 pad 0.6)
  Top 0.254: v20.12,21.86 20.37,22.11 23.11,22.11 v23.57,21.66 | v44.81,18.35 44.17,18.35 41.5,21.02 27.2,21.02 v26.82,20.64 | v46.15,18.25 49.51,21.6 56.34,21.6 58.42,23.69 D.P$3 | R.P$3 66.04,30.6 64.01,28.56 64.01,24.6 64.82,23.79 D.P$4 | Y.P$3 86.36,34.3 85.9,34.76 73.36,34.76 72.54,33.95 R.P$4 | K.P$3 109.22,23.79 106.78,23.79 103.23,27.35 101.32,27.35 100.84,27.83 100.84,31.01 97.09,34.76 93.7,34.76 Y.P$4 | v19,20.97 18.79,21.17 18.79,21.41 18.41,21.8 15.83,21.8 15.81,21.78 15.47,21.78 IC2.9
  Bottom 0.254: v19,20.97 19.89,21.86 v20.12,21.86 | v23.57,21.66 23.88,21.66 24.89,20.64 v26.82,20.64 | v46.15,18.25 46.05,18.35 v44.81,18.35
LID4  (via drill 0.3 pad 0.6)
  Top 0.254: v17.17,21.05 16.97,21.25 16.36,21.25 16.05,20.95 15.75,20.95 IC2.10 | v18.09,20.13 18.09,19.83 20.22,17.69 20.22,17.39 v20.83,16.78 | v44.6,17.29 45.41,18.1 45.41,20.84 48.26,23.69 S.P$3 | E.P$3 55.88,30.6 53.54,28.26 v53.54,27.55 | v53.44,25.31 53.44,25.01 54.66,23.79 S.P$4 | v114.91,26.13 117.25,23.79 119.38,23.79 L.P$3 | v113.61,26.28 105.64,26.28 v103.53,28.39 | v102.13,29.66 101.24,30.55 101.24,31.18 97.26,35.17 74.27,35.17 v73.86,35.58 | v72.95,36.49 64.92,36.49 62.38,33.95 E.P$4 | v23.06,16.78 43.28,16.78 v43.69,16.37 43.18,15.87 Z.P$3
  Bottom 0.254: v18.09,20.13 v17.17,21.05 | v23.06,16.78 v20.83,16.78 | v43.69,16.37 v44.6,17.29 | v53.54,27.55 53.44,27.45 v53.44,25.31 | v114.91,26.13 113.77,26.13 v113.61,26.28 | v103.53,28.39 102.26,29.66 v102.13,29.66 | v72.95,36.49 v73.86,35.58
LID5  (via drill 0.3 pad 0.6)
  Top 0.254: M.P$4 110.64,13.63 114.3,13.63 CLEAR.P$3 | v18.21,21.17 16.87,19.83 IC2.12 | v19.51,22.47 19.63,22.6 24.11,22.6 v24.28,22.77 | v25.81,21.86 25.93,21.99 32.92,21.99 36.98,26.05 60.12,26.05 v63.8,22.37 | v64.72,21.45 66.34,21.45 68.58,23.69 F.P$3 | T.P$3 76.2,30.6 74.17,28.56 74.17,24.6 74.98,23.79 F.P$4 | v97.33,18.71 102.41,13.63 104.14,13.63 M.P$3 | v89.51,26.53 88.7,27.35 88.59,27.35 82.7,33.24 82.7,33.85 T.P$4 | v90.42,25.62 v95.86,20.18
  Bottom 0.254: v19.51,22.47 v18.21,21.17 | v24.28,22.77 24.89,22.77 v25.81,21.86 | v64.72,21.45 v63.8,22.37 | v97.33,18.71 v95.86,20.18 | v89.51,26.53 v90.42,25.62
LID6  (via drill 0.3 pad 0.6)
  Top 0.254: v17.4,22.6 15.47,22.6 14.12,21.25 14.12,21.05 16.36,18.81 16.76,18.81 17.07,19.12 17.37,19.12 IC2.13 | v23.77,23.38 23.47,23.08 18.77,23.08 v18.41,23.46 | v25.81,23.08 25.93,22.95 31.57,22.95 37.8,29.17 42.47,29.17 45.11,26.53 v63.4,26.53 | v72.44,24.5 73.15,24.5 74.78,22.88 77.93,22.88 78.74,23.69 G.P$3 | v93.98,15.36 N.P$3 | v92.15,17.19 92.15,17.59 v88.8,20.95 | ENTER.P$3 124.46,13.4 123.14,12.08 101.68,12.08 100.49,13.27 N.P$4 | 87.88,23.99 87.65,23.76 G.P$4 | v87.88,21.86 87.88,23.99 | 87.88,23.99 96.52,32.63 U.P$3 | v65.13,26.53 66.02,27.42 69.52,27.42 v70.41,26.53
  Bottom 0.254: v23.77,23.38 25.5,23.38 v25.81,23.08 | v65.13,26.53 v63.4,26.53 | v72.44,24.5 v70.41,26.53 | v92.15,17.19 v93.98,15.36 | v87.88,21.86 v88.8,20.95 | v18.41,23.46 17.55,22.6 v17.4,22.6
N$1
  Top 0.508: Q1.1 12.12,26.55 IC2.8
  Top 1.27: C10.2 8.29,26.55 Q1.1
N$2
  Top 0.508: Q1.2 12.37,27.43 IC2.7
  Top 1.27: Q1.2 12.37,30.82 C11.2
N$3
  Top 0.254: LCD1.3 52.1,42.5 51,43.6 43.13,43.6 R3.2
N$5
  Top 0.381: MINI-USB-B.D+ 11.43,46.8 10.32,45.69 IC1.15
N$6
  Top 0.381: MINI-USB-B.D- 12.23,46.84 10.43,45.04 IC1.16
N$8
  Top 0.381: IC1.2 17.55,37.89 19.05,36.39 C1.2
N$15
  Top 0.254: RESET.P$4 6.92,9.96 R21.1
RESET  (via drill 0.3 pad 0.6)
  Top 0.254: R4.1 20.93,33.65 19.1,33.65 C1.1 19.05,32.9 20.28,31.67 | 20.28,31.67 23.39,28.55 23.39,26.31 IC2.29 | v19.1,30.39 17.2,30.39 14.1,27.3 v13.69,27.3 | v20.42,31.71 20.32,31.71 20.28,31.67 | v12.01,25.64 11.76,25.39 11.76,17.26 10.41,15.92 J4.5 RESET.P$2
  Bottom 0.254: v13.69,27.3 12.04,25.64 v12.01,25.64 | v20.42,31.71 v19.1,30.39
RS
  Top 0.254: LCD1.4 55.62,42.02 54.05,40.45 40.64,40.45 39.42,39.23 39.42,36.59 35.87,33.03 32.61,33.03 24.28,24.7 24.08,24.7 IC2.27
RX
  Top 0.381: R2.2 17.02,36.9
  Top 0.432: 17.02,36.9 16.67,37.24 IC1.1
TX
  Top 0.381: IC1.5 15.65,39.84 14.99,39.18 R1.2
VUSB
  Top 0.508: C2.1 C9.1 16.51,49.66 | MINI-USB-B.VBUS 15.17,49.66 16.51,49.66 | D2.A 16.51,49.66

### Text on the board
tNames: RESET SCK MISO | GND MOSI 5 V
bNames: HEL computer met passcode / (c) Kaya Hartwig 2019
tStop: пароль